# Altium schematic sheet Page 3.SchDoc
size 840 x 594 mm; Address1: Address1; Address2: Address2; Address3: Address3; Address4: Address4; DocumentNumber: НЭС.185014.2017-5.1; SheetNumber: 3; SheetTotal: 3; Scale: 1:1; DocumentType: Схема электрическая принципиальная; FirstReferrence: НЭС.185014.2017-5.1
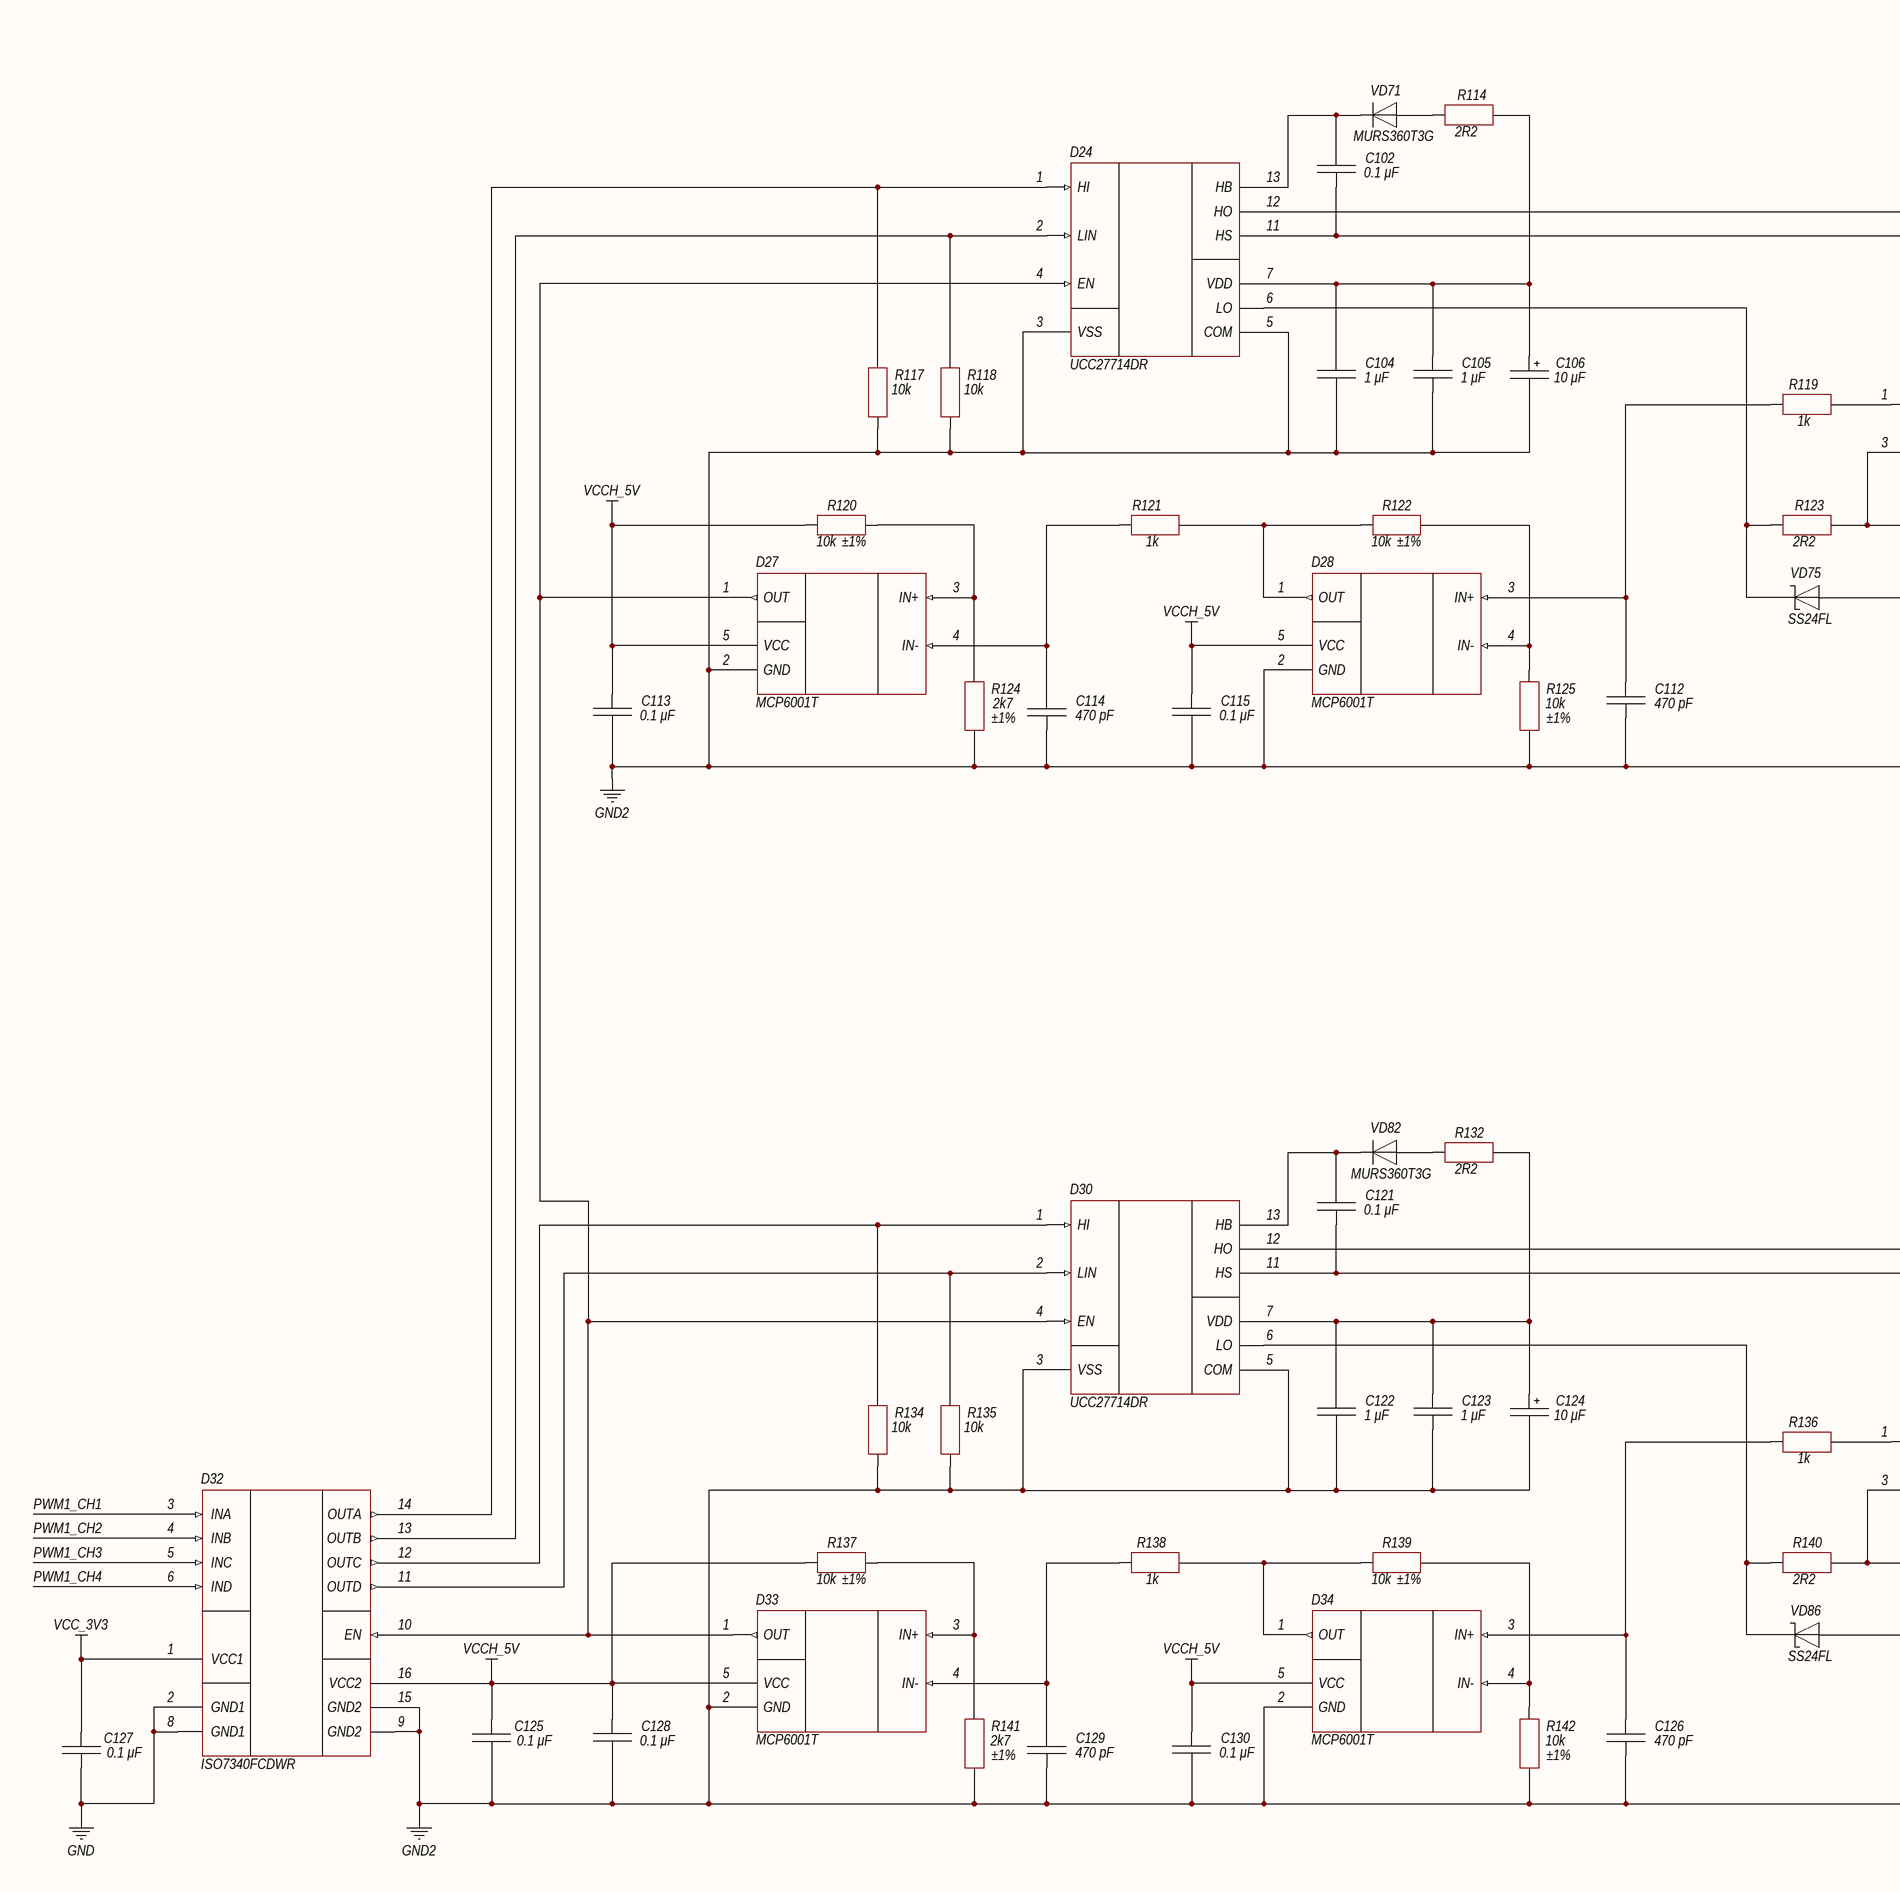
[diagram p0: Page 3.SchDoc, left]
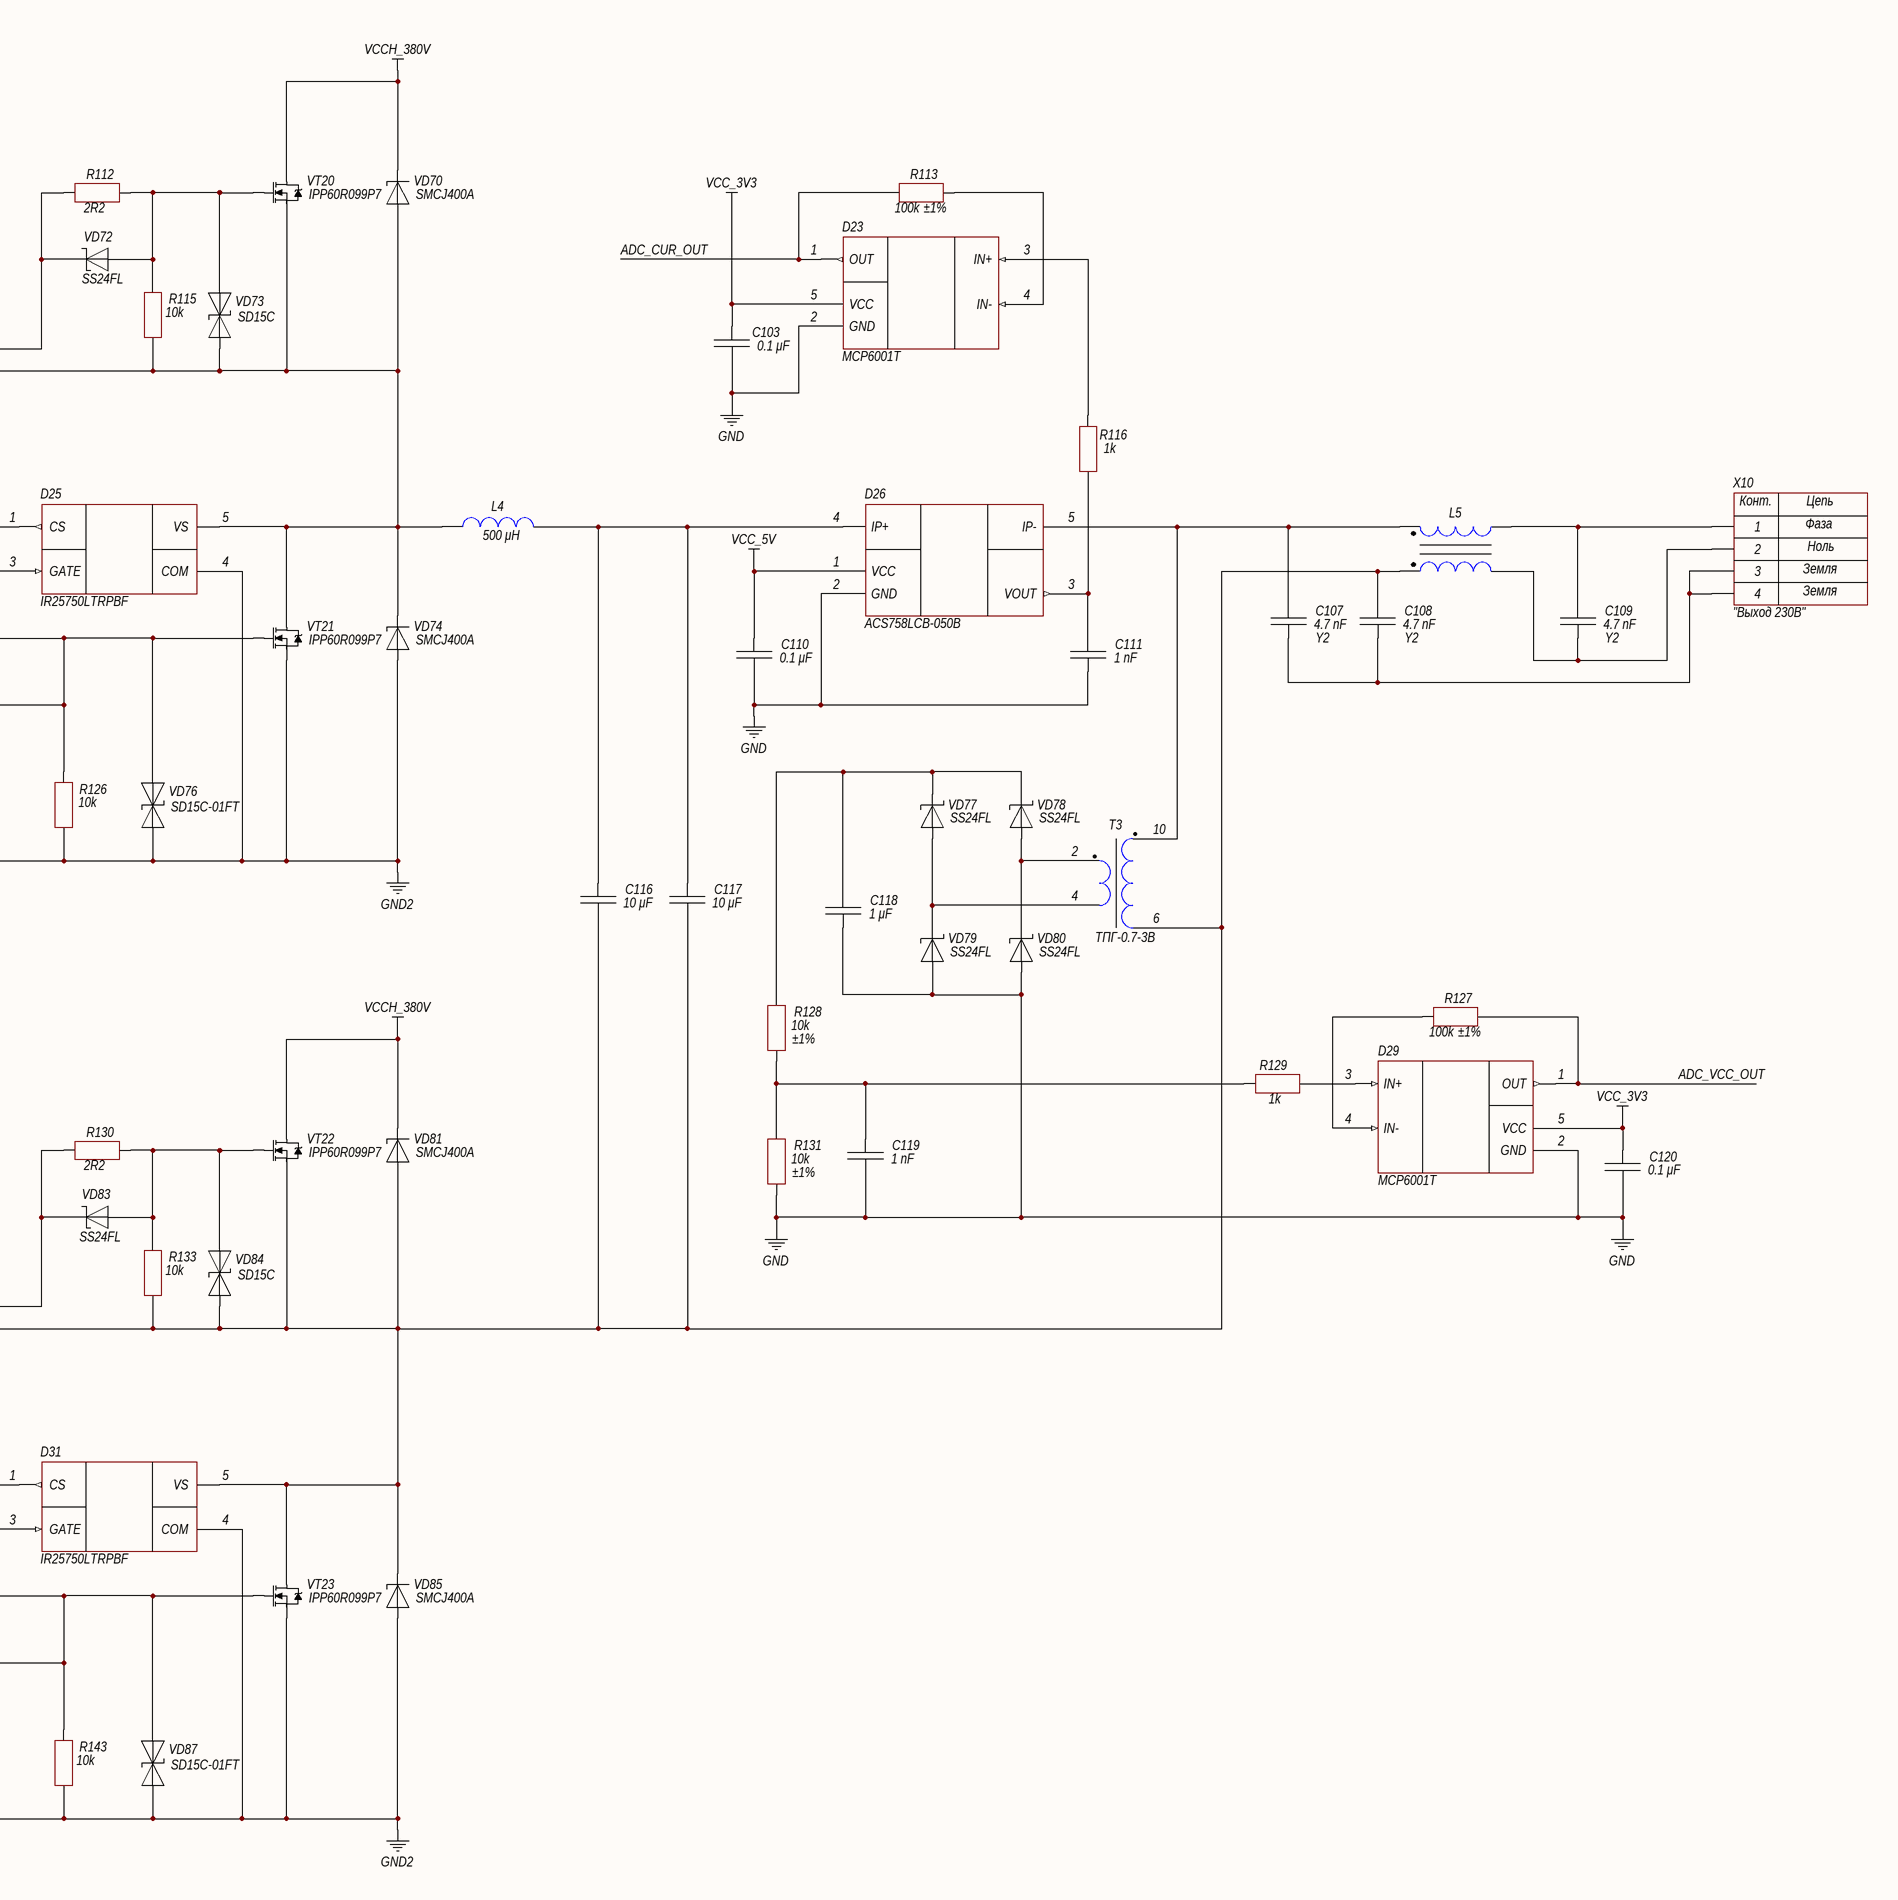
[diagram p1: Page 3.SchDoc, right]

## Parts
C102  0.1 μF  [CH0805C]
C103  0.1 μF  [CH0805C]
C104  1 μF  [CH0805C]
C105  1 μF  [CH0805C]
C106  10 μF  [TANTAL_C]
C107  4.7 nF  ComponentKind: Y2  [CAP: B32021]
C108  4.7 nF  ComponentKind: Y2  [CAP: B32021]
C109  4.7 nF  ComponentKind: Y2  [CAP: B32021]
C110  0.1 μF  [CH0805C]
C111  1 nF  [CH0805C]
C112  470 pF  [CH0805C]
C113  0.1 μF  [CH0805C]
C114  470 pF  [CH0805C]
C115  0.1 μF  [CH0805C]
C116  10 μF  [CAP: B32676]
C117  10 μF  [CAP: B32676]
C118  1 μF  [CH0805C]
C119  1 nF  [CH0805C]
C120  0.1 μF  [CH0805C]
C121  0.1 μF  [CH0805C]
C122  1 μF  [CH0805C]
C123  1 μF  [CH0805C]
C124  10 μF  [TANTAL_C]
C125  0.1 μF  [CH0805C]
C126  470 pF  [CH0805C]
C127  0.1 μF  [CH0805C]
C128  0.1 μF  [CH0805C]
C129  470 pF  [CH0805C]
C130  0.1 μF  [CH0805C]
D23  MCP6001T  [SOT23-5]
D24  UCC27714DR  [14-SOIC]
D25  IR25750LTRPBF  [SOT23-5]
D26  ACS758LCB-050B  [IC: ACS770]
D27  MCP6001T  [SOT23-5]
D28  MCP6001T  [SOT23-5]
D29  MCP6001T  [SOT23-5]
D30  UCC27714DR  [14-SOIC]
D31  IR25750LTRPBF  [SOT23-5]
D32  ISO7340FCDWR  [16-SOIC (W)]
D33  MCP6001T  [SOT23-5]
D34  MCP6001T  [SOT23-5]
L4  500 μH  [IND: R46]
L5  0077071A7  [IND: R32]  (value not drawn)
R112  2R2  [CH0805R]
R113  100k  ComponentKind: ±1%  [CH0805R]
R114  2R2  [CH0805R]
R115  10k  [CH0805R]
R116  1k  [CH0805R]
R117  10k  [CH0805R]
R118  10k  [CH0805R]
R119  1k  [CH0805R]
R120  10k  ComponentKind: ±1%  [CH0805R]
R121  1k  [CH0805R]
R122  10k  ComponentKind: ±1%  [CH0805R]
R123  2R2  [CH0805R]
R124  2k7  ComponentKind: ±1%  [CH0805R]
R125  10k  ComponentKind: ±1%  [CH0805R]
R126  10k  [CH0805R]
R127  100k  ComponentKind: ±1%  [CH0805R]
R128  10k  ComponentKind: ±1%  [CH0805R]
R129  1k  [CH0805R]
R130  2R2  [CH0805R]
R131  10k  ComponentKind: ±1%  [CH0805R]
R132  2R2  [CH0805R]
R133  10k  [CH0805R]
R134  10k  [CH0805R]
R135  10k  [CH0805R]
R136  1k  [CH0805R]
R137  10k  ComponentKind: ±1%  [CH0805R]
R138  1k  [CH0805R]
R139  10k  ComponentKind: ±1%  [CH0805R]
R140  2R2  [CH0805R]
R141  2k7  ComponentKind: ±1%  [CH0805R]
R142  10k  ComponentKind: ±1%  [CH0805R]
R143  10k  [CH0805R]
T3  ТПГ-0.7-3В  [TRANS: ТПК-7]
VD70  SMCJ400A  [SMC]
VD71  MURS360T3G  [SMC]
VD72  SS24FL  [SOD123F]
VD73  SD15C  [SOD323]
VD74  SMCJ400A  [SMC]
VD75  SS24FL  [SOD123F]
VD76  SD15C-01FT  [SOD323]
VD77  SS24FL  [SOD123F]
VD78  SS24FL  [SOD123F]
VD79  SS24FL  [SOD123F]
VD80  SS24FL  [SOD123F]
VD81  SMCJ400A  [SMC]
VD82  MURS360T3G  [SMC]
VD83  SS24FL  [SOD123F]
VD84  SD15C  [SOD323]
VD85  SMCJ400A  [SMC]
VD86  SS24FL  [SOD123F]
VD87  SD15C-01FT  [SOD323]
VT20  IPP60R099P7  [TO220_123]
VT21  IPP60R099P7  [TO220_123]
VT22  IPP60R099P7  [TO220_123]
VT23  IPP60R099P7  [TO220_123]
X10  "Выход 230В"  [CON: X977B04]

## Nets
GND: C103.1 C110.1 C111.1 C118.1 C119.1 C120.1 C127.1 D23.2(GND) D26.2(GND) D29.2(GND) D32.2(GND1) D32.8(GND1) R131.2 VD79.1 VD80.1
GND2: C104.1 C105.1 C106.2 C112.2 C113.1 C114.2 C115.1 C122.1 C123.1 C124.2 C125.1 C126.2 C128.1 C129.2 C130.1 D24.3(VSS) D24.5(COM) D25.4(COM) D27.2(GND) D28.2(GND) D30.3(VSS) D30.5(COM) D31.4(COM) D32.9(GND2) D32.15(GND2) D33.2(GND) D34.2(GND) R117.1 R118.1 R124.2 R125.2 R126.1 R134.1 R135.1 R141.2 R142.2 R143.1 VD74.1(A) VD76.1(A) VD85.1(A) VD87.1(A) VT21.3(S) VT23.3(S)
VCC_3V3: C103.2 C120.2 C127.2 D23.5(VCC) D29.5(VCC) D32.1(VCC1)
VCC_5V: C110.2 D26.1(VCC)
VCCH_5V: C113.2 C115.2 C125.2 C128.2 C130.2 D27.5(VCC) D28.5(VCC) D32.16(VCC2) D33.5(VCC) D34.5(VCC) R120.2 R137.2
VCCH_380V: VD70.2(C) VD81.2(C) VT20.2(D) VT22.2(D)
ADC_CUR_OUT: D23.1(OUT) R113.1
ADC_VCC_OUT: D29.1(OUT) R127.2
PWM1_CH1: D32.3(INA)
PWM1_CH2: D32.4(INB)
PWM1_CH3: D32.5(INC)
PWM1_CH4: D32.6(IND)
NetC102_1: C102.1 D24.11(HS) D25.5(VS) L4.2 R115.1 VD70.1(A) VD73.1(A) VD74.2(C) VT20.3(S) VT21.2(D)
NetC102_2: C102.2 D24.13(HB) VD71.2
NetC104_2: C104.2 C105.2 C106.1 D24.7(VDD) R114.1
NetC107_1: C107.1 C108.1 X10.3 X10.4
NetC107_2: C107.2 D26.5(IP-) L5.1 T3.10
NetC108_2: C108.2 C116.1 C117.1 C121.1 D30.11(HS) D31.5(VS) L5.3 R133.1 T3.6 VD81.1(A) VD84.1(A) VD85.2(C) VT22.3(S) VT23.2(D)
NetC109_1: C109.1 L5.4 X10.2
NetC109_2: C109.2 L5.2 X10.1
NetC111_2: C111.2 D26.3(VOUT) R116.2
NetC112_1: C112.1 D28.3(IN+) R119.1
NetC114_1: C114.1 D27.4(IN-) R121.2
NetC116_2: C116.2 C117.2 D26.4(IP+) L4.1
NetC118_2: C118.2 R128.1 VD77.2 VD78.2
NetC119_2: C119.2 R128.2 R129.2 R131.1
NetC121_2: C121.2 D30.13(HB) VD82.2
NetC122_2: C122.2 C123.2 C124.1 D30.7(VDD) R132.1
NetC126_1: C126.1 D34.3(IN+) R136.1
NetC129_1: C129.1 D33.4(IN-) R138.2
NetD23_3: D23.3(IN+) R116.1
NetD23_4: D23.4(IN-) R113.2
NetD24_1: D24.1(HI) D32.14(OUTA) R117.2
NetD24_2: D24.2(LIN) D32.13(OUTB) R118.2
NetD24_4: D24.4(EN) D27.1(OUT) D30.4(EN) D32.10(EN) D33.1(OUT)
NetD24_6: D24.6(LO) R123.2 VD75.2
NetD24_12: D24.12(HO) R112.2 VD72.2
NetD25_1: D25.1(CS) R119.2
NetD25_3: D25.3(GATE) R123.1 R126.2 VD75.1 VD76.2(C) VT21.1(G)
NetD27_3: D27.3(IN+) R120.1 R124.1
NetD28_1: D28.1(OUT) R121.1 R122.1
NetD28_4: D28.4(IN-) R122.2 R125.1
NetD29_3: D29.3(IN+) R129.1
NetD29_4: D29.4(IN-) R127.1
NetD30_1: D30.1(HI) D32.12(OUTC) R134.2
NetD30_2: D30.2(LIN) D32.11(OUTD) R135.2
NetD30_6: D30.6(LO) R140.2 VD86.2
NetD30_12: D30.12(HO) R130.2 VD83.2
NetD31_1: D31.1(CS) R136.2
NetD31_3: D31.3(GATE) R140.1 R143.2 VD86.1 VD87.2(C) VT23.1(G)
NetD33_3: D33.3(IN+) R137.1 R141.1
NetD34_1: D34.1(OUT) R138.1 R139.1
NetD34_4: D34.4(IN-) R139.2 R142.1
NetR112_1: R112.1 R115.2 VD72.1 VD73.2(C) VT20.1(G)
NetR114_2: R114.2 VD71.1
NetR130_1: R130.1 R133.2 VD83.1 VD84.2(C) VT22.1(G)
NetR132_2: R132.2 VD82.1
NetT3_2: T3.2 VD78.1 VD80.2
NetT3_4: T3.4 VD77.1 VD79.2

## Notes on the sheet
- Фаза
- Ноль
- Земля
- Перв. примен.
- Справ. №
- Подп. и дата
- Инв. № дубл.
- Взам. инв. №
- Инв. № подл.
- Изм.
- Лист
- № докум.
- Подп.
- Дата
- 2.106-A2
- Копировал
- Формат А1
- (in symbol 4-Connector) Конт.; Цепь

## Library data of the parts
C102 C103 C110 C113 C115 C120 C121 C125 C127 C128 C130 = Capacitor: Manufacturer: Yageo; Model: CC0805KRX7R8BB104; HelpURL: https://www.digikey.com/product-detail/en/yageo/CC0805KRX7R8BB104/311-1141-1-ND/303051; ComponentKind: X7R; Value: 0.1 μF
C104 C105 C118 C122 C123 = Capacitor: Manufacturer: Yageo; Model: CC0805KKX7R8BB105; HelpURL: https://www.digikey.com/product-detail/en/yageo/CC0805KKX7R8BB105/311-1456-1-ND/2833762; ComponentKind: X7R; Value: 1 μF
C106 C124 = TantalCap: Manufacturer: Vishay Sprague; Model: TR3C106K025C0300; HelpURL: https://www.digikey.com/product-detail/en/vishay-sprague/TR3C106K025C0300/718-1508-1-ND/1859983; ComponentKind: 25V; Value: 10 μF
C107-C109 = Capacitor: Manufacturer: EPCOS (TDK); Model: B32021A3472M; HelpURL: https://www.digikey.com/product-detail/en/epcos-tdk/B32021A3472M000/495-4082-ND/2045205; Value: 4.7 nF
C111 C119 = Capacitor: Manufacturer: Yageo; Model: CC0805KRX7R9BB102; HelpURL: https://www.digikey.com/product-detail/en/yageo/CC0805KRX7R9BB102/311-1127-1-ND/303037; ComponentKind: X7R; Value: 1 nF
C112 C114 C126 C129 = Capacitor: Manufacturer: Yageo; Model: CC0805KRX7R9BB471; HelpURL: https://www.digikey.com/product-detail/en/yageo/CC0805KRX7R9BB471/311-1124-1-ND/303034; ComponentKind: X7R; Value: 470 pF
C116 C117 = Capacitor: Manufacturer: Epcos; Model: B32676E4106K000; HelpURL: https://www.digikey.com/products/en?keywords=B32676E4106K000; ComponentKind: 275V AC; Value: 10 μF
D23 D27-D29 D33 D34 = MCP6001T: OP amplifier; Manufacturer: Microchip Technology; Model: MCP6001T-I/OT; HelpURL: https://www.digikey.com/product-detail/en/microchip-technology/MCP6001T-I-OT/MCP6001T-I-OTCT-ND/697158; ComponentKind: SOT23-5
D24 D30 = UCC27714DR: Half-bridge driver; Manufacturer: Texas Instruments; Model: UCC27714DR; HelpURL: https://www.digikey.com/product-detail/en/texas-instruments/UCC27714DR/296-42701-1-ND/5455966; ComponentKind: 14-SOIC
D25 D31 = IR25750LTRPBF: Sensor; Manufacturer: Infineon Technologies; Model: IR25750LTRPBF; ComponentKind: SOT23-5; HelpURL: https://www.digikey.com/product-detail/en/infineon-technologies/IR25750LTRPBF/IR25750LTRPBFCT-ND/4743688
D26 = ACS770LCB: Sensor; Manufacturer: Allegro MicroSystems, LLC; Model: ACS758LCB-050B-PFF-T; HelpURL: https://www.digikey.com/product-detail/en/allegro-microsystems-llc/ACS758LCB-050B-PFF-T/620-1320-ND/2042745; ComponentKind: 40mV/A
D32 = ISO7340FCDWR: Isolator; Manufacturer: Texas Instruments; Model: ISO7340FCDWR; ComponentKind: 16-SOIC; HelpURL: https://www.digikey.com/product-detail/en/texas-instruments/ISO7340FCDWR/296-47262-1-ND/7688272
L4 = Inductor ring: Manufacturer: Magnetics; Model: 0077439A7; Value: 500 μH; ComponentKind: 60 μ; HelpURL: http://ferrite.ru/warehouse/r-46-724-118-77439-a7.html
L5 = EMI filter: Manufacturer: Magnetics; Model: 0077071A7; HelpURL: http://ferrite.ru/warehouse/r-32-820-110-7-77071-a7.html; ComponentKind: R32/20/10
R112 R114 R123 R130 R132 R140 = Resistor: Manufacturer: Yageo; Model: RC0805JR-072R2L; HelpURL: https://www.digikey.com/product-detail/en/yageo/RC0805JR-072R2L/311-2.2ARCT-ND/731217; ComponentKind: 0805; Value: 2R2
R113 R127 = Resistor: Manufacturer: Yageo; Model: RC0805FR-07100KL; HelpURL: https://www.digikey.com/product-detail/en/yageo/RC0805FR-07100KL/311-100KCRCT-ND/730491; Value: 100k
R115 R117 R118 R126 R133-R135 R143 = Resistor: Manufacturer: Yageo; Model: RC0805JR-0710KL; HelpURL: https://www.digikey.com/product-detail/en/yageo/RC0805JR-0710KL/311-10KARCT-ND/731188; ComponentKind: 0805; Value: 10k
R116 R119 R121 R129 R136 R138 = Resistor: Manufacturer: Yageo; Model: RC0805JR-071KL; HelpURL: https://www.digikey.com/product-detail/en/yageo/RC0805JR-071KL/311-1.0KARCT-ND/731165; ComponentKind: 0805; Value: 1k
R120 R122 R125 R128 R131 R137 R139 R142 = Resistor: Manufacturer: Yageo; Model: RC0805FR-0710KL; HelpURL: https://www.digikey.com/product-detail/en/yageo/RC0805FR-0710KL/311-10.0KCRCT-ND/730482; Value: 10k
R124 R141 = Resistor: Manufacturer: Yageo; Model: RC0805FR-072K7L; HelpURL: https://www.digikey.com/product-detail/en/yageo/RC0805FR-072K7L/311-2.70KCRCT-ND/730653; Value: 2k7
T3 = Sensor: Manufacturer: НПК «Комплекс»; Model: ТПГ-0.7-3В; HelpURL: https://www.chipdip.ru/product/tpk-0.7-3v; ComponentKind: Voltage sensor
VD70 VD74 VD81 VD85 = Diod Zener: Manufacturer: Littelfuse Inc.; ComponentKind: SMC; Model: SMCJ400A; HelpURL: https://www.digikey.com/product-detail/en/littelfuse-inc/SMCJ400A/SMCJ400ALFCT-ND/762670
VD71 VD82 = Diod: Manufacturer: ON Semiconductor; ComponentKind: SMC; Model: MURS360T3G; HelpURL: https://www.digikey.com/product-detail/en/on-semiconductor/MURS360T3G/MURS360T3GOSCT-ND/964580
VD72 VD75 VD77-VD80 VD83 VD86 = Diod Schottky: Manufacturer: Fairchild/ON Semiconductor; ComponentKind: SOD-123F; Model: SS24FL; HelpURL: https://www.digikey.com/product-detail/en/fairchild-on-semiconductor/SS24FL/SS24FLCT-ND/5305093
VD73 VD76 VD84 VD87 = TVS-diod: Manufacturer: Littelfuse Inc.; Model: SD15C-01FTG; ComponentKind: SOD-323; HelpURL: https://www.digikey.com/product-detail/en/littelfuse-inc/SD15C-01FTG/F6444CT-ND/5019598
VT20-VT23 = N-chanel: Mosfet; Manufacturer: Infineon Technologies; Model: IPP60R099P7XKSA1; ComponentKind: TO-220; HelpURL: https://www.digikey.com/products/en?keywords=IPP60R099P7XKSA1
X10 = 4-Connector: Manufacturer: Ningbo Xinya M&E; Model: X977B04; HelpURL: https://www.chipdip.ru/product/x977b04; ComponentKind: 10A